# EAGLE design CAN_RS232_bridge (EAGLE 5.11)
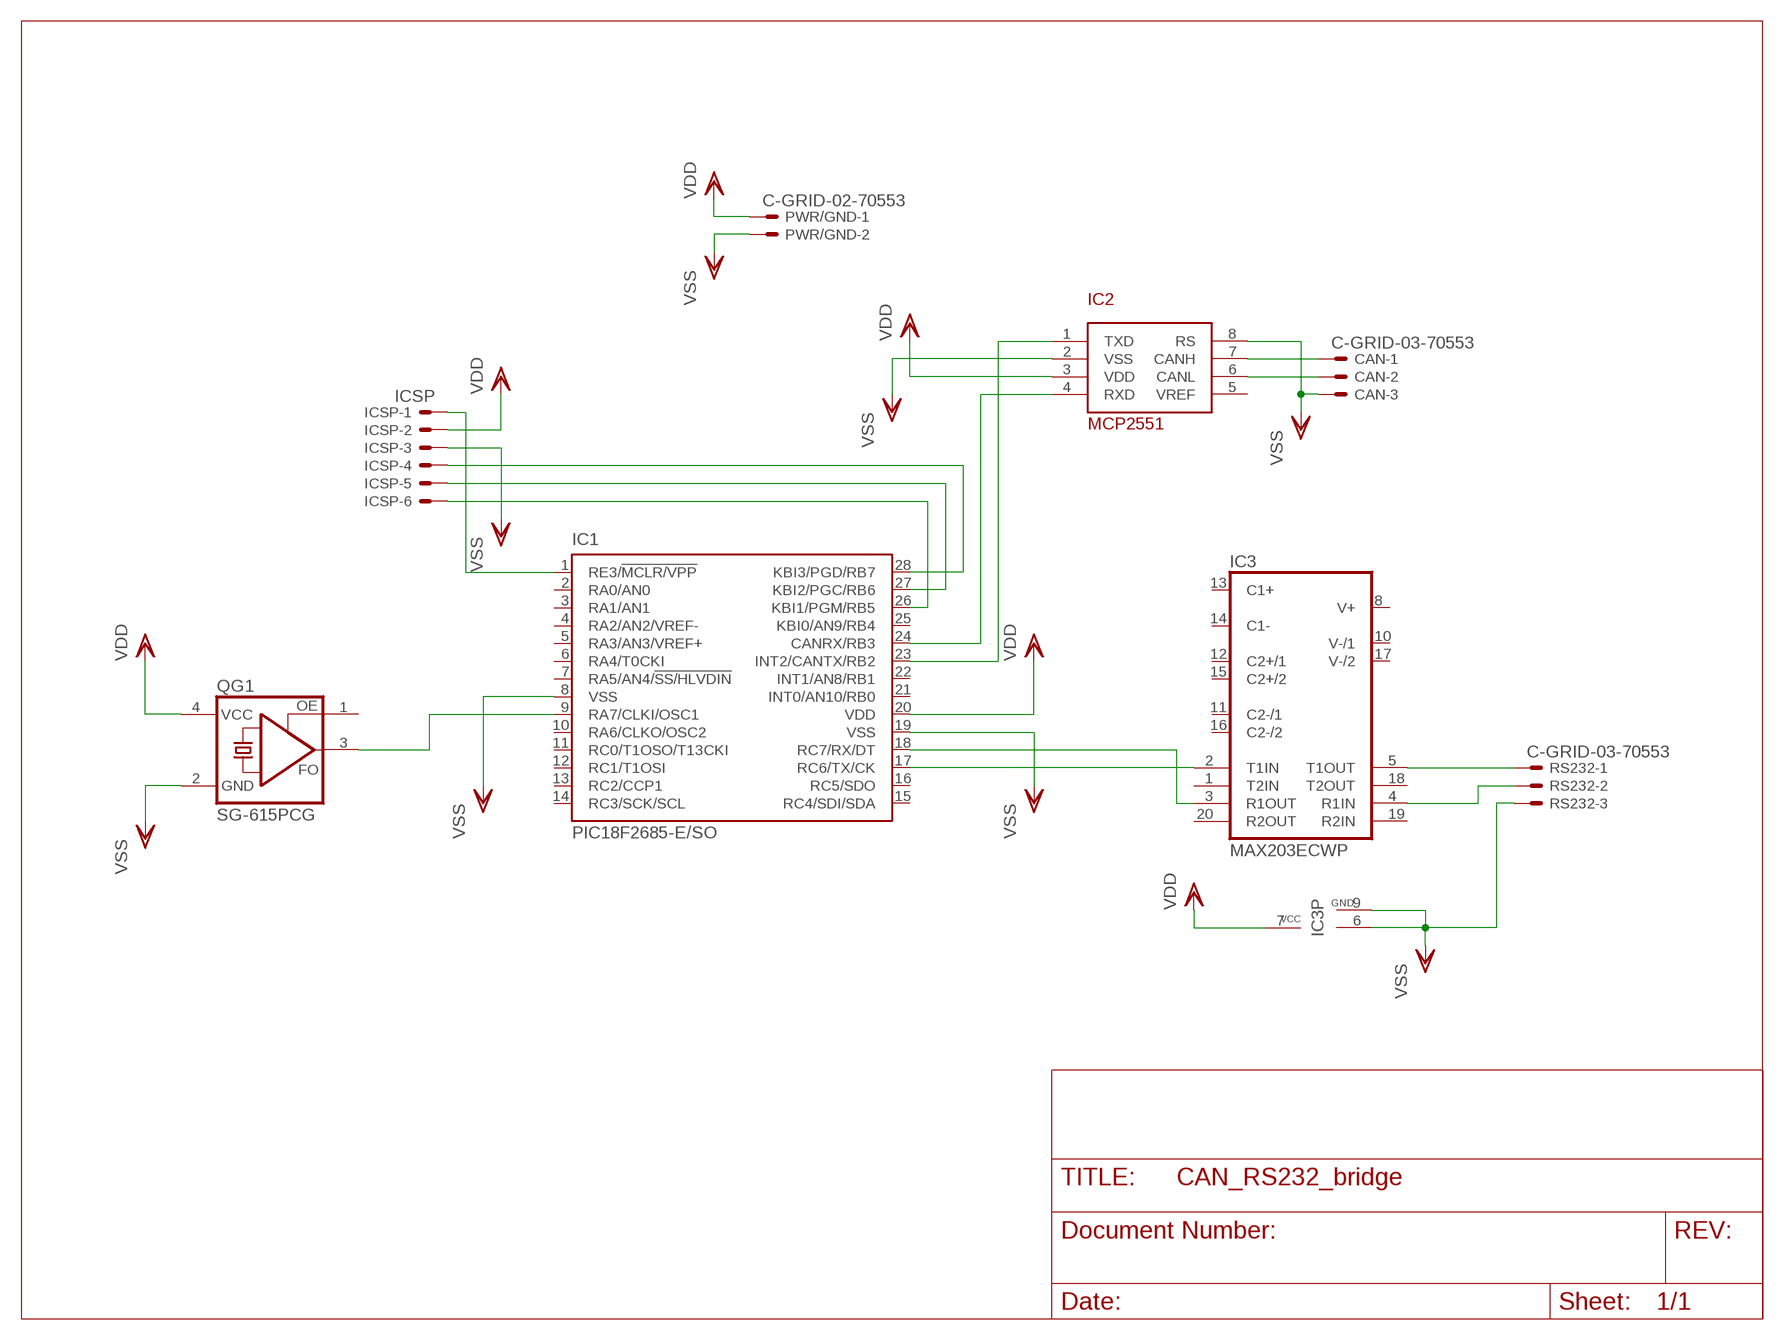
[diagram p0: schematic, sheet 1]

## Parts
CAN  C-GRID-03-70553  [70553-03]
IC1  PIC18F2685-E/SO  PIC18F2580-E/SO  [SO28W]
IC2  MCP2551  [SO-08]
IC3  MAX203ECWP  [SO20L]
ICSP  ICSP  22-23-2061  [22-23-2061]
PWR/GND  C-GRID-02-70553  [70553-02]
QG1  SG-615PCG  [SG-615]
RS232  C-GRID-03-70553  [70553-03]

## Nets
N$1: IC1.24(CANRX/RB3) IC2.4(RXD)
N$2: IC1.23(INT2/CANTX/RB2) IC2.1(TXD)
N$3: IC1.17(RC6/TX/CK) IC3.2(T1IN)
N$4: IC1.18(RC7/RX/DT) IC3.3(R1OUT)
N$5: IC3.5(T1OUT) RS232.1
N$6: IC3.4(R1IN) RS232.2
N$7: CAN.1 IC2.7(CANH)
N$8: CAN.2 IC2.6(CANL)
N$9: IC1.1(RE3/!MCLR/VPP) ICSP.1
N$10: IC1.28(KBI3/PGD/RB7) ICSP.4
N$11: IC1.27(KBI2/PGC/RB6) ICSP.5
N$12: IC1.26(KBI1/PGM/RB5) ICSP.6
N$13: IC1.9(RA7/CLKI/OSC1) QG1.3(FO)
VDD: IC1.20(VDD) IC2.3(VDD) IC3.7(VCC) ICSP.2 PWR/GND.1 QG1.4(VCC)
VSS: CAN.3 IC1.8(VSS) IC1.19(VSS) IC2.2(VSS) IC2.8(RS) IC3.6(GND) IC3.9(GND) ICSP.3 PWR/GND.2 QG1.2(GND) RS232.3
Unconnected: IC1.2(RA0/AN0) IC1.3(RA1/AN1) IC1.4(RA2/AN2/VREF-) IC1.5(RA3/AN3/VREF+) IC1.6(RA4/T0CKI) IC1.7(RA5/AN4/!SS/HLVDIN) IC1.10(RA6/CLKO/OSC2) IC1.11(RC0/T1OSO/T13CKI) IC1.12(RC1/T1OSI) IC1.13(RC2/CCP1) IC1.14(RC3/SCK/SCL) IC1.15(RC4/SDI/SDA) IC1.16(RC5/SDO) IC1.21(INT0/AN10/RB0) IC1.22(INT1/AN8/RB1) IC1.25(KBI0/AN9/RB4) IC2.5(VREF) IC3.1(T2IN) IC3.8(V+) IC3.10(V-/1) IC3.11(C2-/1) IC3.12(C2+/1) IC3.13(C1+) IC3.14(C1-) IC3.15(C2+/2) IC3.16(C2-/2) IC3.17(V-/2) IC3.18(T2OUT) IC3.19(R2IN) IC3.20(R2OUT) QG1.1(OE)

## Library data of the parts
CAN RS232 = con-molex:C-GRID-03: CONNECTOR wire to board 2.54 mm (0.100") pitch header; OC_FARNELL: unknown; OC_NEWARK: unknown
IC1 = microchip:PIC18F2*80: 28-Pin Enhanced Flash Microcontrollers with ECAN(TM) Technology 10-Bit A/D and nanoWatt Technology Source: http://www.microchip.com .. 39637a.pdf; MF: MICROCHIP; MPN: PIC18F2580-I/SO; OC_FARNELL: 9321284; OC_NEWARK: 71J7243
IC2 = microchip:MCP2551: MCP2551 High-Speed CAN Transceiver
IC3 = maxim:MAX203ECWP: RS232 TRANSEIVER; MPN: MAX203ECWP+G36; OC_FARNELL: 1224204; OC_NEWARK: 89K3435
ICSP = con-molex:22-23-2061: .100" (2.54mm) Center Header - 6 Pin; MF: MOLEX; MPN: 22-23-2061; OC_FARNELL: 1462922; OC_NEWARK: 27C1933
PWR/GND = con-molex:C-GRID-02: CONNECTOR wire to board 2.54 mm (0.100") pitch header; OC_FARNELL: unknown; OC_NEWARK: unknown
QG1 = crystal:SG-615: SOJ HIGH-FREQUENCY CRYSTAL OSCILLATOR Source: Crystal Oscillator SG-615%20Series.pdf; MPN: SG615P-50MHZ 50PPM; OC_FARNELL: 1216207; OC_NEWARK: 01M8855

## Board
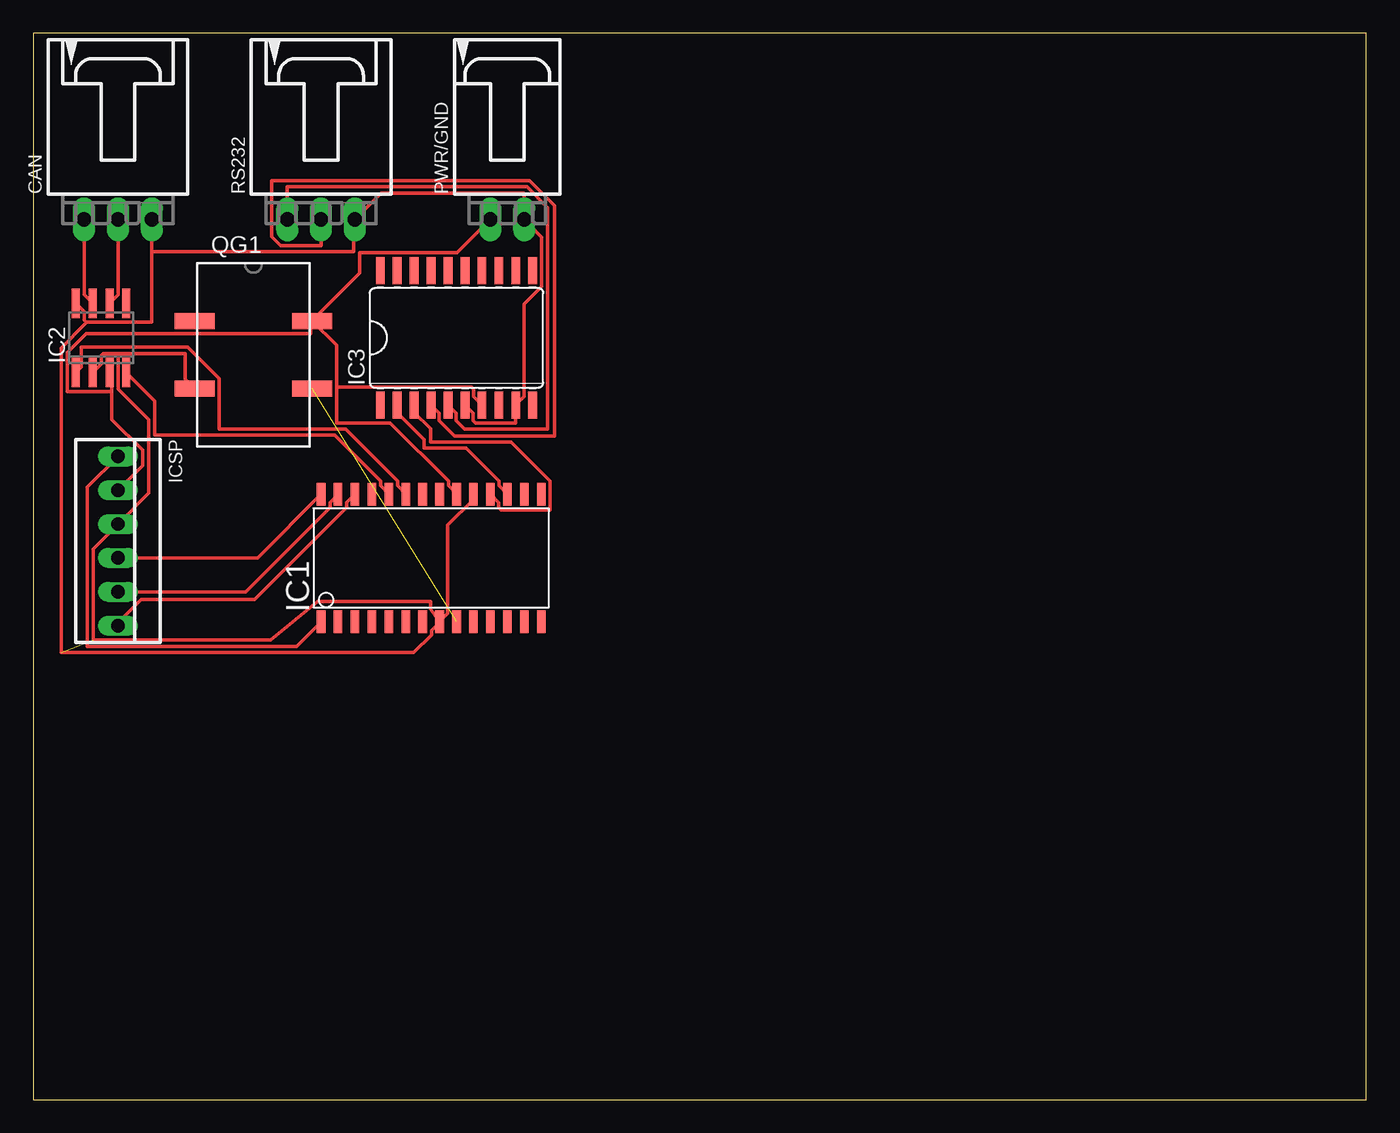
[diagram p1: board, top side]

Size 100 x 80 mm. Coordinates in mm from the lower left corner, seen from the top.
Outline: 0,0 100,0 100,80 0,80 0,0
Copper layers (1*16): Top 0.035mm / dielectric 1.5mm / Bottom 0.035mm
Design rules "default": minimum track width 10mil, minimum drill 24mil, track to track 8mil, track to pad 8mil, pad to pad 8mil, via to via 8mil, smd to smd 8mil, copper to edge 40mil, drill to drill 8mil, minimum pad ring 10mil, minimum via ring 8mil, stop-mask expansion 4mil, vias tented up to drill 0mil, thermal gap 10mil

### Footprints (pad centres in the part's own frame; a part is rotated, then mirrored left to right if it is on the bottom)
70553-03 = drill 1.092 long: 1 -2.54,-7.62; 2 0,-7.62; 3 2.54,-7.62
SO28W = smd 0.65 x 1.7: 1 -7.62,-4.78; 2 -6.35,-4.78; 3 -5.08,-4.78; 4 -3.81,-4.78; 5 -2.54,-4.78; 6 -1.27,-4.78; 7 0,-4.78; 8 1.27,-4.78; 9 2.54,-4.78; 10 3.81,-4.78; 11 5.08,-4.78; 12 6.35,-4.78; 13 7.62,-4.78; 14 8.89,-4.78; 15 8.89,4.78; 16 7.62,4.78; 17 6.35,4.78; 18 5.08,4.78; 19 3.81,4.78; 20 2.54,4.78; 21 1.27,4.78; 22 0,4.78; 23 -1.27,4.78; 24 -2.54,4.78; 25 -3.81,4.78; 26 -5.08,4.78; 27 -6.35,4.78; 28 -7.62,4.78
SO-08 = smd 0.6 x 2.2: 1 -1.905,-2.6; 2 -0.635,-2.6; 3 0.635,-2.6; 4 1.905,-2.6; 5 1.905,2.6; 6 0.635,2.6; 7 -0.635,2.6; 8 -1.905,2.6
SO20L = smd 0.66 x 2.032: 1 -5.715,-5.029; 2 -4.445,-5.029; 3 -3.175,-5.029; 4 -1.905,-5.029; 5 -0.635,-5.029; 6 0.635,-5.029; 7 1.905,-5.029; 8 3.175,-5.029; 9 4.445,-5.029; 10 5.715,-5.029; 11 5.715,5.029; 12 4.445,5.029; 13 3.175,5.029; 14 1.905,5.029; 15 0.635,5.029; 16 -0.635,5.029; 17 -1.905,5.029; 18 -3.175,5.029; 19 -4.445,5.029; 20 -5.715,5.029
22-23-2061 = drill 1 long: 1 -6.35,0; 2 -3.81,0; 3 -1.27,0; 4 1.27,0; 5 3.81,0; 6 6.35,0
70553-02 = drill 1.092 long: 1 -1.27,-7.62; 2 1.27,-7.62
SG-615 = smd 1.2 x 3: 1 -2.54,-4.4; 2 2.54,-4.4; 3 2.54,4.4; 4 -2.54,4.4

### Placement (x,y rotation side)
CAN  6.35,73.66 0 top
IC1  29.21,40.64 0 top
IC2  5.08,57.15 0 top
IC3  31.75,57.15 0 top
ICSP  6.35,41.91 270 top
PWR/GND  35.56,73.66 0 top
QG1  16.51,55.88 270 top
RS232  21.59,73.66 0 top

### Tracks (layer width: path | path; a pad name or v marks a point on that pad's centre or on a via)
N$1
  Top 0.254: IC1.24 26.67,45.44 26.06,46.05 26.06,46.41 22.61,49.86 9.12,49.86 9.12,52.4 6.99,54.53 IC2.4
N$2
  Top 0.254: IC1.23 27.94,45.44 27.33,46.05 27.33,46.41 23.42,50.32 13.95,50.32 13.95,54.08 11.58,56.44 3.58,56.44 3.58,54.97 IC2.1
N$3
  Top 0.254: IC3.2 27.3,51.56 29.34,49.53 29.34,48.87 32.49,48.87 34.95,46.41 34.95,46.05 35.56,45.44 IC1.17
N$4
  Top 0.254: IC3.3 28.57,51.56 29.79,50.34 29.79,49.33 35.84,49.33 38.76,46.41 38.76,44.22 35.1,44.22 34.9,44.42 34.9,44.81 IC1.18
N$5
  Top 0.254: IC3.5 31.73,51.51 31.73,50.95 32.36,50.32 38.58,50.32 38.58,66.93 37.03,68.48 19.05,68.48 RS232.1
N$6
  Top 0.254: IC3.4 30.45,51.51 30.45,50.95 31.62,49.78 39.12,49.78 39.12,67.06 37.24,68.94 17.88,68.94 17.88,64.75 18.57,64.06 21.59,64.06 RS232.2
N$7
  Top 0.254: CAN.1 3.81,60.4 4.45,59.77 IC2.7
N$8
  Top 0.254: CAN.2 6.35,60.4 5.71,59.77 IC2.6
N$9
  Top 0.254: ICSP.1 4.04,45.95 4.04,34.01 19.76,34.01 21.59,35.84 IC1.1
N$10
  Top 0.254: ICSP.4 16.82,40.64 IC1.28
N$11
  Top 0.254: ICSP.5 15.93,38.1 22.25,44.42 22.25,44.81 IC1.27
N$12
  Top 0.254: ICSP.6 6.35,35.79 8.08,37.52 16.61,37.52 23.52,44.42 23.52,44.81 IC1.26
N$13  (1 unrouted)
VDD
  Top 0.254: 5.89,53.11 5.89,51.03 8.2,48.72 8.2,47.57 ICSP.2 | 5.89,53.11 5.89,54.36 5.71,54.53 IC2.3 | 22.76,53.47 22.76,56.59 20.93,58.42 QG1.4 | 22.76,53.47 22.76,50.77 26.77,50.77 31.14,46.41 31.14,46.05 31.75,45.44 IC1.20 | IC3.7 33.05,52.73 33.05,53.29 32.87,53.47 22.76,53.47 | PWR/GND.1 31.77,63.52 24.49,63.52 24.49,62 21.01,58.52 QG1.4 | 5.89,53.11 2.54,53.11 2.54,56.06 3.96,57.48 20.8,57.48 20.8,58.37 QG1.4
VSS  (1 unrouted)
  Top 0.254: IC1.19 33.02,45.03 31.09,43.1 31.09,36.47 IC1.8 30.43,35.74 29.87,35.18 29.87,34.87 28.55,33.55 2.08,33.55 2.08,56.39 3.91,58.22 3.99,58.32 | 6.35,55.98 11.38,55.98 11.38,54.05 12.09,53.34 QG1.2 | 6.35,55.98 5.26,55.98 5.08,55.8 5.08,55.19 IC2.2 | 6.35,55.98 6.35,53.31 8.66,51 8.66,45.49 ICSP.3 6.27,43.08 4.5,41.3 4.5,34.47 17.8,34.47 21.34,37.36 29.82,37.36 29.82,36.8 30.4,35.94 | 3.99,58.32 3.81,58.5 3.81,59.11 IC2.8 | 3.99,58.32 8.89,58.32 8.89,63.6 | 8.89,63.6 CAN.3 | IC3.6 32.99,51.51 32.99,50.95 33.17,50.77 36.2,50.77 IC3.9 36.27,52.22 36.8,52.76 36.8,59.69 38.12,61.01 38.12,64.72 36.91,65.94 PWR/GND.2 36.83,68.02 26.11,68.02 RS232.3 24.03,65.96 24.03,63.6 8.89,63.6